# Altium project FPGA_Board.PrjPCB (part 2 of 2)
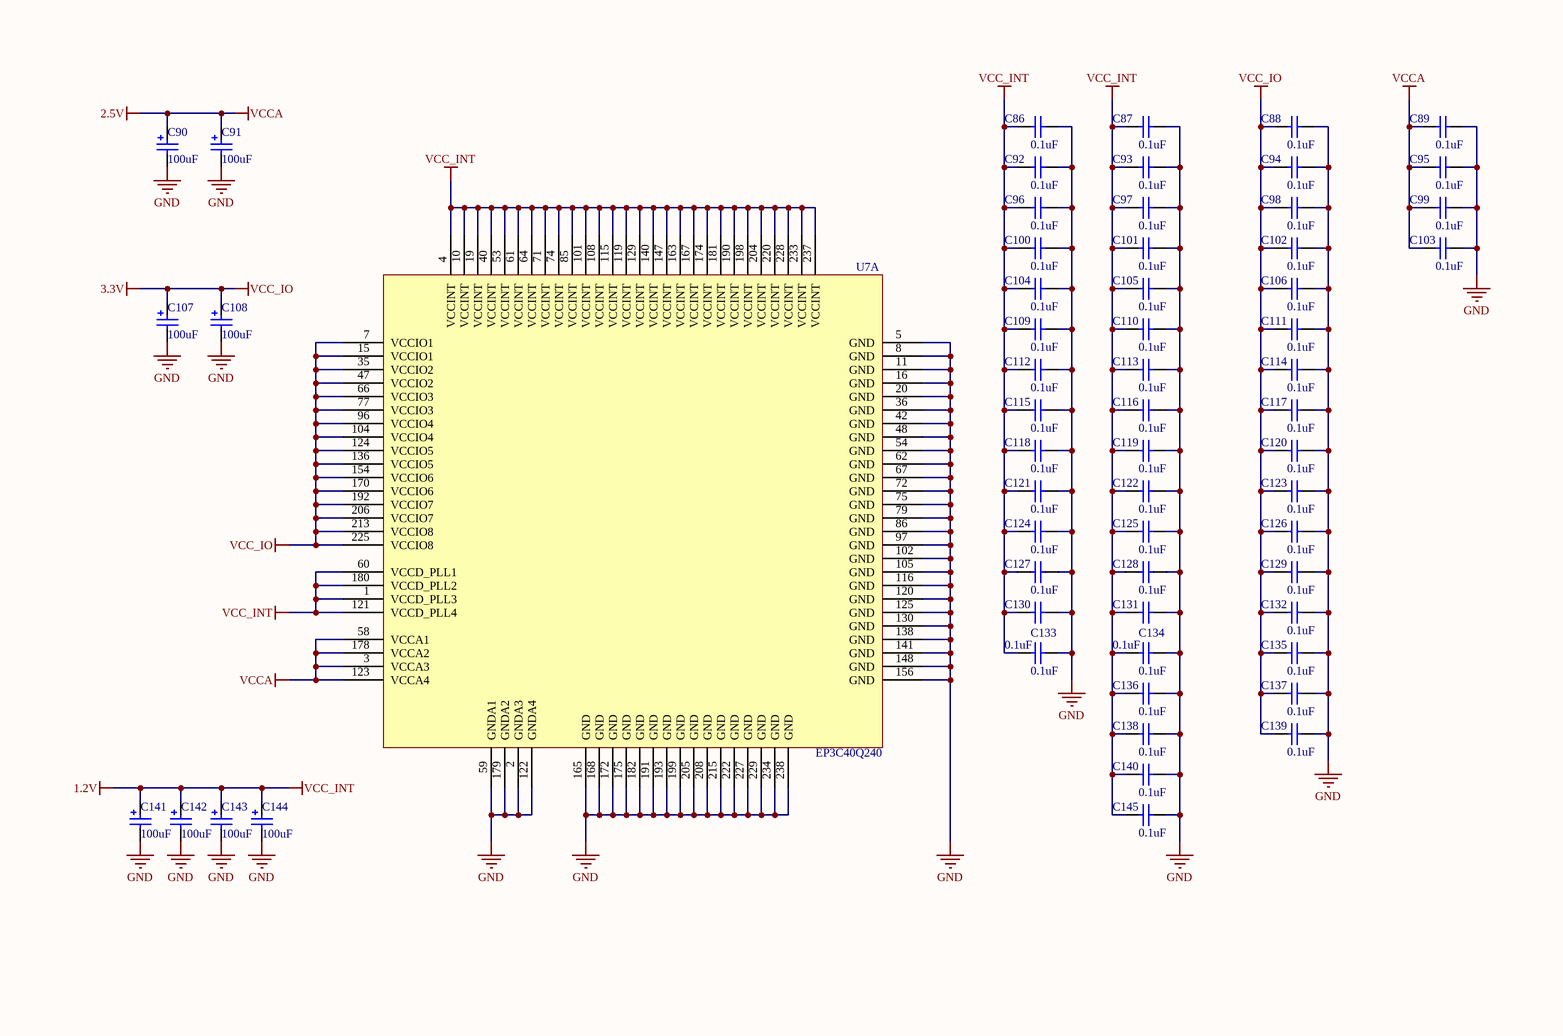
[diagram p7: core_power.SchDoc]

## Nets that join several sheets
1.2V: Video (36 pins), power (7 pins), core_power (68 pins)
2.5V: core (R38.1 R39.1 U8.4), ports (J8.3), power (6 pins), core_power (10 pins)
3.3V: core (11 pins), Video (42 pins), ports (20 pins), power (6 pins), memory (29 pins), core_power (34 pins)
5V_IN: ports (J8.1 J8.2), power (37 pins)
GND: core (12 pins), Video (95 pins), ports (43 pins), power (48 pins), memory (34 pins), core_power (106 pins)
BTN1: core (U7.32), ports (C42.2 R26.2 S2.2)
BTN2: core (U7.33), ports (C41.2 R25.2 S1.2)
GPI0: core (U7.89), ports (D13.3 J5.3)
GPI1: core (U7.90), ports (D14.3 J5.13)
GPI2: core (U7.91), ports (D15.3 J5.4)
GPI3: core (U7.211), ports (D16.3 J5.14)
GPI4: core (U7.212), ports (D19.3 J5.5)
GPI5: core (U7.149), ports (D20.3 J5.15)
GPI6: core (U7.150), ports (D21.3 J5.6)
GPI7: core (U7.151), ports (D22.3 J5.16)
GPIO0: core (U7.203), ports (D8.3 J5.1)
GPIO1: core (U7.207), ports (D9.3 J5.11)
GPIO2: core (U7.200), ports (D11.3 J5.2)
GPIO3: core (U7.223), ports (D12.3 J5.12)
LED1: core (U7.70), ports (R16.2)
LED2: core (U7.55), ports (R19.2)
LED3: core (U7.56), ports (R22.2)
PS2_CLK: core (U7.224), ports (D5.3 R23.1)
PS2_DATA: core (U7.230), ports (D6.3 R20.1)
SRAM_ADDR0: core (U7.21), memory (U10.37)
SRAM_ADDR1: core (U7.22), memory (U10.36)
SRAM_ADDR2: core (U7.50), memory (U10.32)
SRAM_ADDR3: core (U7.46), memory (U10.33)
SRAM_ADDR4: core (U7.44), memory (U10.34)
SRAM_ADDR5: core (U7.39), memory (U10.35)
SRAM_ADDR6: core (U7.18), memory (U10.42)
SRAM_ADDR7: core (U7.13), memory (U10.43)
SRAM_ADDR8: core (U7.9), memory (U10.44)
SRAM_ADDR9: core (U7.6), memory (U10.45)
SRAM_ADDR10: core (U7.240), memory (U10.46)
SRAM_ADDR11: core (U7.239), memory (U10.47)
SRAM_ADDR12: core (U7.236), memory (U10.48)
SRAM_ADDR13: core (U7.235), memory (U10.49)
SRAM_ADDR14: core (U7.232), memory (U10.50)
SRAM_ADDR15: core (U7.118), memory (U10.81)
SRAM_ADDR16: core (U7.117), memory (U10.82)
SRAM_ADDR17: core (U7.107), memory (U10.99)
SRAM_ADDR18: core (U7.106), memory (U10.100)
SRAM_ADSC_n: core (U7.112), memory (U10.85)
SRAM_ADSP_n: core (U7.113), memory (U10.84)
SRAM_ADV_n: core (U7.114), memory (U10.83)
SRAM_BWE_n: core (U7.110), memory (U10.87)
SRAM_CE2_n: core (U7.84), memory (R46.1 U10.92)
SRAM_CE_n: core (U7.83), memory (R45.2 U10.98)
SRAM_CLK: core (U7.69), memory (U10.89)
SRAM_DQ0: core (U7.226), memory (U10.52)
SRAM_DQ1: core (U7.221), memory (U10.53)
SRAM_DQ2: core (U7.219), memory (U10.56)
SRAM_DQ3: core (U7.217), memory (U10.57)
SRAM_DQ4: core (U7.202), memory (U10.58)
SRAM_DQ5: core (U7.201), memory (U10.59)
SRAM_DQ6: core (U7.197), memory (U10.62)
SRAM_DQ7: core (U7.194), memory (U10.63)
SRAM_DQ8: core (U7.171), memory (U10.68)
SRAM_DQ9: core (U7.137), memory (U10.69)
SRAM_DQ10: core (U7.135), memory (U10.72)
SRAM_DQ11: core (U7.134), memory (U10.73)
SRAM_DQ12: core (U7.132), memory (U10.74)
SRAM_DQ13: core (U7.131), memory (U10.75)
SRAM_DQ14: core (U7.127), memory (U10.78)
SRAM_DQ15: core (U7.126), memory (U10.79)
SRAM_DQ16: core (U7.98), memory (U10.2)
SRAM_DQ17: core (U7.94), memory (U10.3)
SRAM_DQ18: core (U7.93), memory (U10.6)
SRAM_DQ19: core (U7.88), memory (U10.7)
SRAM_DQ20: core (U7.87), memory (U10.8)
SRAM_DQ21: core (U7.82), memory (U10.9)
SRAM_DQ22: core (U7.81), memory (U10.12)
SRAM_DQ23: core (U7.57), memory (U10.13)
SRAM_DQ24: core (U7.52), memory (U10.18)
SRAM_DQ25: core (U7.51), memory (U10.19)
SRAM_DQ26: core (U7.49), memory (U10.22)
SRAM_DQ27: core (U7.45), memory (U10.23)
SRAM_DQ28: core (U7.43), memory (U10.24)
SRAM_DQ29: core (U7.41), memory (U10.25)
SRAM_DQ30: core (U7.38), memory (U10.28)
SRAM_DQ31: core (U7.37), memory (U10.29)
SRAM_MODE: core (U7.68), memory (R48.1 U10.31)
SRAM_OE_n: core (U7.111), memory (R44.2 U10.86)
SRAM_PAR0: core (U7.231), memory (U10.51)
SRAM_PAR1: core (U7.103), memory (U10.80)
SRAM_PAR2: core (U7.100), memory (U10.1)
SRAM_PAR3: core (U7.95), memory (U10.30)
SRAM_ZZ: core (U7.189), memory (R47.1 U10.64)
UART_RXD: core (U7.92), ports (U3.1)
UART_TXD: core (U7.99), ports (U3.5)
VGA1_B0: core (U7.161), Video (U2.99)
VGA1_B1: core (U7.162), Video (U2.98)
VGA1_B2: core (U7.176), Video (U2.88)
VGA1_B3: core (U7.177), Video (U2.87)
VGA1_B4: core (U7.164), Video (U2.92)
VGA1_B5: core (U7.166), Video (U2.91)
VGA1_B6: core (U7.169), Video (U2.90)
VGA1_B7: core (U7.173), Video (U2.89)
VGA1_CS_n: core (U7.196), Video (U2.123)
VGA1_DC_n: core (U7.183), Video (U2.122)
VGA1_E_n: core (U7.128), Video (U2.121)
VGA1_G0: core (U7.144), Video (U2.113)
VGA1_G1: core (U7.145), Video (U2.112)
VGA1_G2: core (U7.146), Video (U2.111)
VGA1_G3: core (U7.214), Video (U2.107)
VGA1_G4: core (U7.216), Video (U2.106)
VGA1_G5: core (U7.218), Video (U2.105)
VGA1_G6: core (U7.159), Video (U2.104)
VGA1_G7: core (U7.160), Video (U2.103)
VGA1_PIXEL_CLK: core (U7.209), Video (U2.38)
VGA1_R0: core (U7.188), Video (U2.7)
VGA1_R1: core (U7.187), Video (U2.8)
VGA1_R2: core (U7.186), Video (U2.9)
VGA1_R3: core (U7.185), Video (U2.10)
VGA1_R4: core (U7.184), Video (U2.11)
VGA1_R5: core (U7.139), Video (U2.116)
VGA1_R6: core (U7.142), Video (U2.115)
VGA1_R7: core (U7.143), Video (U2.114)
VGA1_RESET_n: core (U7.195), Video (U2.127)
VGA1_RW_n: core (U7.133), Video (U2.120)
VGA1_TE: core (U7.210), Video (U2.50)
VGA2_B: core (U7.80), Video (R11.2)
VGA2_G: core (U7.78), Video (R10.2)
VGA2_HSync: core (U7.73), Video (R12.2)
VGA2_R: core (U7.76), Video (R9.2)
VGA2_VSync: core (U7.63), Video (R13.2)